# Altium project MHI_Board.PrjPcb
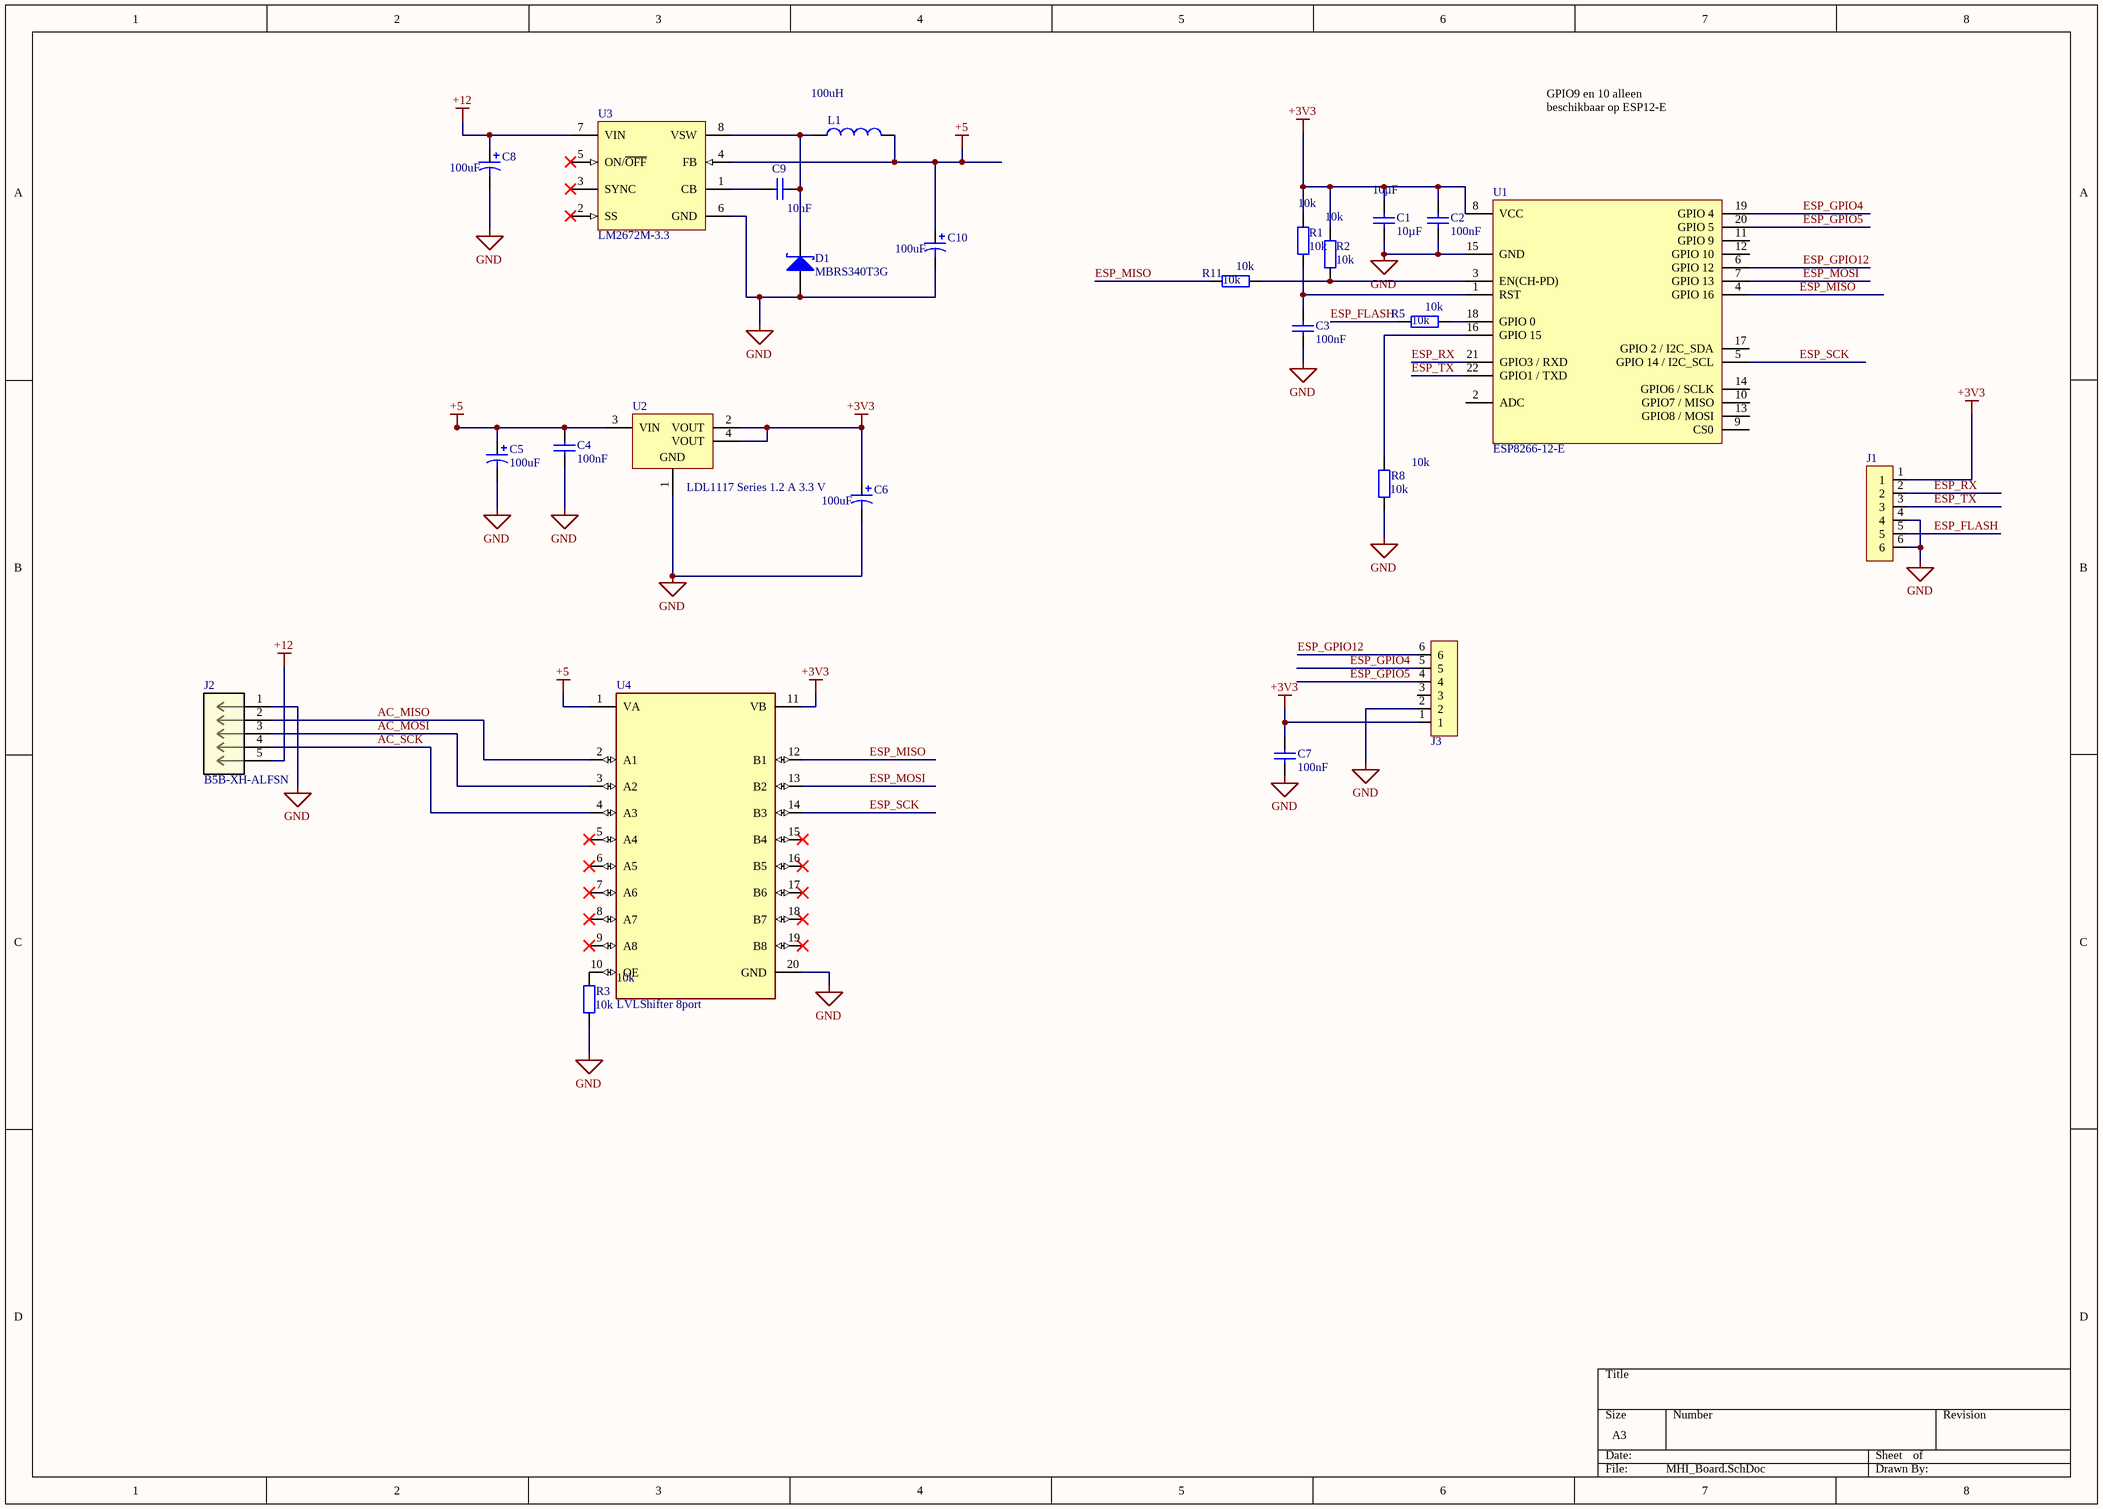
[diagram p0: MHI_Board.SchDoc]
Year: 2024; SheetnrArrangementTop: 16; SheetnrArrangementBot: 17; ProjNr: 7701 306 01.1; ProjName: MHI-AC-CTRL; GlobalRevision: 0; EngProj: EngProj; EngChecked: EngChecked; EngApproved: EngApproved; DateChecked: DateChecked; DateApproved: DateApproved; ClientRefrence: ClientRefrence; Client: Client
1 sheet, 25 parts. Net scope: global (net labels, ports and power ports of the same name join across sheets).
Board file: MHI_Board.PcbDoc

## Sheet MHI_Board.SchDoc
size A3; SheetNumber: 1; SheetTotal: 1

### Parts
C1  10µF  [CAPC2013X145X50NL20T25]
C2  100nF  [CAPC1608X90X35ML10T15]
C3  100nF  [CAPC1608X90X35ML10T15]
C4  100nF  [CAPC1608X90X35ML10T15]
C5  Capacitance: 100uF  [ELECTRO-SMD-D-5.6MM]  (hidden comment: Panasonic EEE-FT1E101AP)
C6  Capacitance: 100uF  [ELECTRO-SMD-D-5.6MM]  (hidden comment: Panasonic EEE-FT1E101AP)
C7  100nF  [CAPC1608X90X35ML10T15]
C8  Capacitance: 100uF  [ELECTRO-SMD-D-5.6MM]  (hidden comment: Panasonic EEE-FT1E101AP)
C9  Capacitance: 10nF  [CAPC2013X94X50NL20T25]  (hidden comment: AVX Interconnect / Elco 08051C103KAZ2A)
C10  Capacitance: 100uF  [ELECTRO-SMD-D-5.6MM]  (hidden comment: Panasonic EEE-FT1E101AP)
D1  Manufacturer Part Number: MBRS340T3G  [ONSC-SMC_AP419]  (hidden comment: ON Semiconductor MBRS340T-3G)
J1  TE Connectivity / AMP 5-146280-6  [PCB-inh0upq8uddmt7lk8pts-1]  (value not drawn)
J2  B5B-XH-ALFSN  [CONN_B5B-XH-ALFSN_JST]
J3  TE Connectivity / AMP 5-146280-6  [PCB-inh0upq8uddmt7lk8pts-1]  (value not drawn)
L1  Inductance: 100uH  [PCB-910519-1]  (hidden comment: TDK SLF7045T-101MR50-PF)
R1  10k  [RESC1609X50X30ML10T20]
R2  10k  [RESC1609X50X30ML10T20]
R3  10k  [RESC1609X50X30ML10T20]
R5  10k  [RESC1609X50X30ML10T20]
R8  10k  [RESC1609X50X30ML10T20]
R11  10k  [RESC1609X50X30ML10T20]
U1  ESP8266-12-E  [2491]
U2  LDL1117 Series 1.2 A 3.3 V  [PCB-elchkyvpbzx92dsq0s9t-1]
U3  LM2672M-3.3  [M08A_M]
U4  LVLShifter 8port  [FP-N20A-W]

### Nets
+3V3: C1.2 C2.2 C6.1(+) C7.2 J1.1 J3.1 R1.2 R2.2 U1.8(VCC) U2.2(VOUT) U2.4(VOUT) U4.11(VB)
+5: C4.2 C5.1(+) C10.1(+) L1.2 U2.3(VIN) U3.4(FB) U4.1(VA)
+12: C8.1(+) J2.5 U3.7(VIN)
GND: C1.1 C2.1 C3.1 C4.1 C5.2(-) C6.2(-) C7.1 C8.2(-) C10.2(-) D1.2(A) J1.4 J1.6 J2.1 J3.2 R3.1 R8.1 U1.15(GND) U2.1(GND) U3.6(GND) U4.20(GND)
AC_MISO: J2.2 U4.2(A1)
AC_MOSI: J2.3 U4.3(A2)
AC_SCK: J2.4 U4.4(A3)
ESP_FLASH: J1.5 R5.2
ESP_GPIO4: J3.5 U1.19(GPIO_4)
ESP_GPIO5: J3.4 U1.20(GPIO_5)
ESP_GPIO12: J3.6 U1.6(GPIO_12)
ESP_MISO: R11.2 U1.4(GPIO_16) U4.12(B1)
ESP_MOSI: U1.7(GPIO_13) U4.13(B2)
ESP_RX: J1.2 U1.21(GPIO3_/_RXD)
ESP_SCK: U1.5(GPIO_14_/_I2C_SCL) U4.14(B3)
ESP_TX: J1.3 U1.22(GPIO1_/_TXD)
NetC3_2: C3.2 R1.1 U1.1(RST)
NetC9_1: C9.1 U3.1(CB)
NetC9_2: C9.2 D1.1(C) L1.1 U3.8(VSW)
NetR2_1: R2.1 R11.1 U1.3(EN(CH-PD))
NetR3_2: R3.2 U4.10(OE)
NetR5_1: R5.1 U1.18(GPIO_0)
NetR8_2: R8.2 U1.16(GPIO_15)

Not connected (* = marked no-connect by the designer): J3 3; U1 2(ADC) 9(CS0) 10(GPIO7_/_MISO) 11(GPIO_9) 12(GPIO_10) 13(GPIO8_/_MOSI) 14(GPIO6_/_SCLK) 17(GPIO_2_/_I2C_SDA); U3 2(SS)* 3(SYNC)* 5(ON/~{OFF})*; U4 5(A4)* 6(A5)* 7(A6)* 8(A7)* 9(A8)* 15(B4)* 16(B5)* 17(B6)* 18(B7)* 19(B8)*

### Notes on the sheet
- GPIO9 en 10 alleen beschikbaar op ESP12-E

### Library data of the parts
C1 = CMP-158161-2: Cap Ceramic 10uF 6.3V X5R 20% SMD 0805 85C Plastic T/R; Lead-Free Status: Lead Free; Capacitance: 10µF; Capacitance Tolerance: ±20%; Case/Package: 0805; Dielectric Characteristic: X5R; Dielectric Material: Ceramic; Mounting Style: Surface Mount; Octopart Url: https://octopart.com/c0805c106m9pactu-kemet-3666789; OctopartID: eb3c22013d3f34fb; Packaging: Cut Tape (CT); RoHS: Compliant; Voltage Rating (DC): 6.3 V
C2-C4 C7 = CMP-119667-3: CAP CER 0.1UF 50V 10% X7R 0603; Lead-Free Status: Lead Free; Voltage Rating (DC): 50.0 V; Capacitance: 100nF; Capacitance Tolerance: ±10%; Dielectric Characteristic: X7R; Octopart Url: https://octopart.com/gcm188r71h104ka57d-murata-7894792; OctopartID: 3480fdf266eeeb47; Packaging: Cut Tape (CT); REACH SVHC Compliance: No SVHC; RoHS: Compliant
C5 C6 C8 C10 = CMP-848b4cb3b4f95b4c-3: Capacitor Alum Elec, 100uf, 20%, 25v, Capacitor Alum Elec, 100uf, 20%, 25v, Smd, Full Reel; Equivalent Series Resistance (ESR): 0.26 Ω; Lead-Free Status: Lead Free; Voltage Rating (DC): 25.0 V; Size-Height: 0.0058 m; Capacitance Tolerance: ±20%; Octopart Url: http://octopart.com/eee-ft1e101ap-panasonic-20059412; RoHS: Compliant; Number of Pins: 2; Size-Diameter: 0.0063 m; OctopartID: 848b4cb3b4f95b4c; Manufacturer Part Number: EEE-FT1E101AP; Seller Landing  Url: https://octopart-clicks.com/click/track?country=US&ak=8157f166&sig=02e6b41&sid=2402&ppid=20059412&vpid=64485157&ct=offers; Lifecycle Status: Not Listed by Manufacturer
C9 = CMP-126385-2: CAP CER 10000PF 100V X7R 0805; Capacitance Tolerance: ±10%; Case/Package (SI): 2012; Dielectric Material: Ceramic Multilayer; Lead-Free Status: Lead Free; Voltage Rating (DC): 100.0 V; Manufacturer Part Number: 08051C103KAZ2A; Case/Package: 0805; Dielectric Characteristic: X7R; Mounting Style: Surface Mount; Number of Pins: 2; Octopart Url: https://octopart.com/08051c103kaz2a-avx+interconnect+%2F+elco-195629; OctopartID: 0499cd91ddd2db5e; REACH SVHC Compliance: No SVHC; RoHS: Compliant; Size-Height: 0.00094 m; Size-Length: 0.00201 m; Size-Width: 0.00125 m
D1 = CMP-13076272-7: ON Semiconductor; Current Rating: 3.0 A; Forward Voltage: 0.525 V; Output Current: A; Polarity: Standard; Lead-Free Status: Lead Free; Voltage Rating (DC): 40.0 V; Number of Pins: 2; Lifecycle Status: Active; Packaging: Cut Tape (CT), Tape & Reel (TR); Mounting Style: Surface Mount; OctopartID: e0522958cf223f95; RoHS: Compliant; Octopart URL: http://octopart.com/mbrs340t3g-on+semiconductor-2582; REACH SVHC Compliance: No SVHC; Halogen Free Status: Halogen Free; Case/Package: SMC
J1 J3 = CMP-5a24914ca12285e3-2: AMPMODU 6 Position 2.54 mm Through Hole Single Row Straight Breakaway Header; Gender: Male; Lead-Free Status: Lead Free; Number of Contacts: 6; Pin Pitch: 2.54 mm; Lifecycle Status: Not Listed by Manufacturer; OctopartID: 5a24914ca12285e3; Color: Black; Number of Rows: 1; Contact Plating: Gold; Contact Material: Phosphor Bronze; Manufacturer Part Number: 5-146280-6; Octopart URL: http://octopart.com/5-146280-6-te+connectivity+%2F+amp-40033888; REACH SVHC Compliance: No SVHC; RoHS: Compliant; Number of Positions: 6; Mounting Style: Through Hole, Vertical
J2 = B5B-XH-ALFSN: No Description Available; Mfr_Name: JST; RefDes: RefDes; Type: Type
L1 = CMP-910519-3: INDUCTOR SHIELD PWR 100UH 7045; Resistance: 0.25 Ω; Resistance Tolerance: ±20%; Shielding: Yes; Lead-Free Status: Lead Free; Manufacturer Part Number: SLF7045T-101MR50-PF; Number of Pins: 2; OctopartID: d5581c57170e0a9f; Size-Width: 0.007 m; Size-Height: 0.0045 m; Octopart Url: https://octopart.com/slf7045t-101mr50-pf-tdk-386864; RoHS: Compliant; Mounting Style: Surface Mount; Size-Length: 0.007 m; REACH SVHC Compliance: No SVHC
R1-R3 R5 R8 R11 = CMP-584891b72cc4878f-1: Resistor; Thick Film; Res 10 Kilohms; Pwr-Rtg 0.1 W; Tol 1%; SMT; 0603; Manufacturer Part Number: CRG0603F10K; ELV Compliant: Compliant; Power Rating: 0.1 W; Resistance: 10k; OctopartID: 584891b72cc4878f; Case/Package: 0603; RoHS: Compliant; Mounting Style: Surface Mount; Lifecycle Status: Active; Octopart URL: http://octopart.com/crg0603f10k-te+connectivity-16077290; Packaging: Tape & Reel (TR)
U1 = CMP-2c9ce6e9266cf35b-45: ESP8266 SMT MODULE; Octopart URL: https://octopart.com/2491-adafruit+industries-65271392; OctopartID: f2f4381d21f22d33; Color: Black; Material: Nylon; Manufacturer Part Number: 2491; RoHS: Compliant
U2 = CMP-9f2a52c1ee8f40ed-1: High PSRR LDO Linear Voltage Regulator-SOT-223; Operating Temperature: -40.0 °C (min); Lifecycle Status: Not Listed by Manufacturer
U3 = CMP-0069-00649-3: SIMPLE SWITCHER® Power Converter High Efficiency 1A Step-Down Voltage Regulator with Features, 8-pin Narrow SOIC; Lead-Free Status: Contains Lead; Number of Outputs: 1; Output Current: 1.0 A; Output Voltage: 3.3 V; Quiescent Current: 0.0025 A; Switching Frequency: 260000.0 Hz; Topology: Buck; Input Voltage (DC): 40.0 V; Case/Package: SOIC; Lifecycle Status: Active; Mounting Style: Surface Mount; Number of Pins: 8; Number of Regulated Outputs: 1; Octopart Url: https://octopart.com/lm2672m-3.3-texas+instruments-24844854; OctopartID: 7ed4b6a54184a113; Packaging: Rail; RoHS: Non-Compliant; Manufacturer Part Number: LM2672M-3.3; Frequency: 260000.0 Hz; REACH SVHC Compliance: No SVHC
U4 = CMP-00278-13160021-1: LevelShifter, PDIP20; Manufacturer: ON Semiconductor / Fairchild; Manufacturer Part Number: MM74HC688N; Number of Gates: 8; Low Level Output Current: 5.2mA; Number of Circuits: 1; Turn-On Delay Time: 30ns; Propagation Delay: 21ns; Quiescent Current: 8µA; Number of Inputs: 2; Max Supply Voltage: 6V; Polarity: Inverting; Min Supply Voltage: 2V; Max Operating Temperature: 85°C; Ambient Temperature Range High: 85°C; Case/Package: DIP; Number of Channels: 8; RoHS: Compliant; NexarPartId: 13160021; REACH SVHC: No SVHC; Mount: Through Hole; Number of Bits: 8; Lead Free: Lead Free; High Level Output Current: 5.2mA; Min Operating Temperature: -40°C; Number of Pins: 20; Termination: Through Hole; Height: 5.08mm; Number of Outputs: 1